# Altium schematic sheet ACD_ACW01_ACWire.SchDoc
size Letter; DocumentNumber: ACD_ACW01_ACWire; SheetNumber: 1; SheetTotal: 1
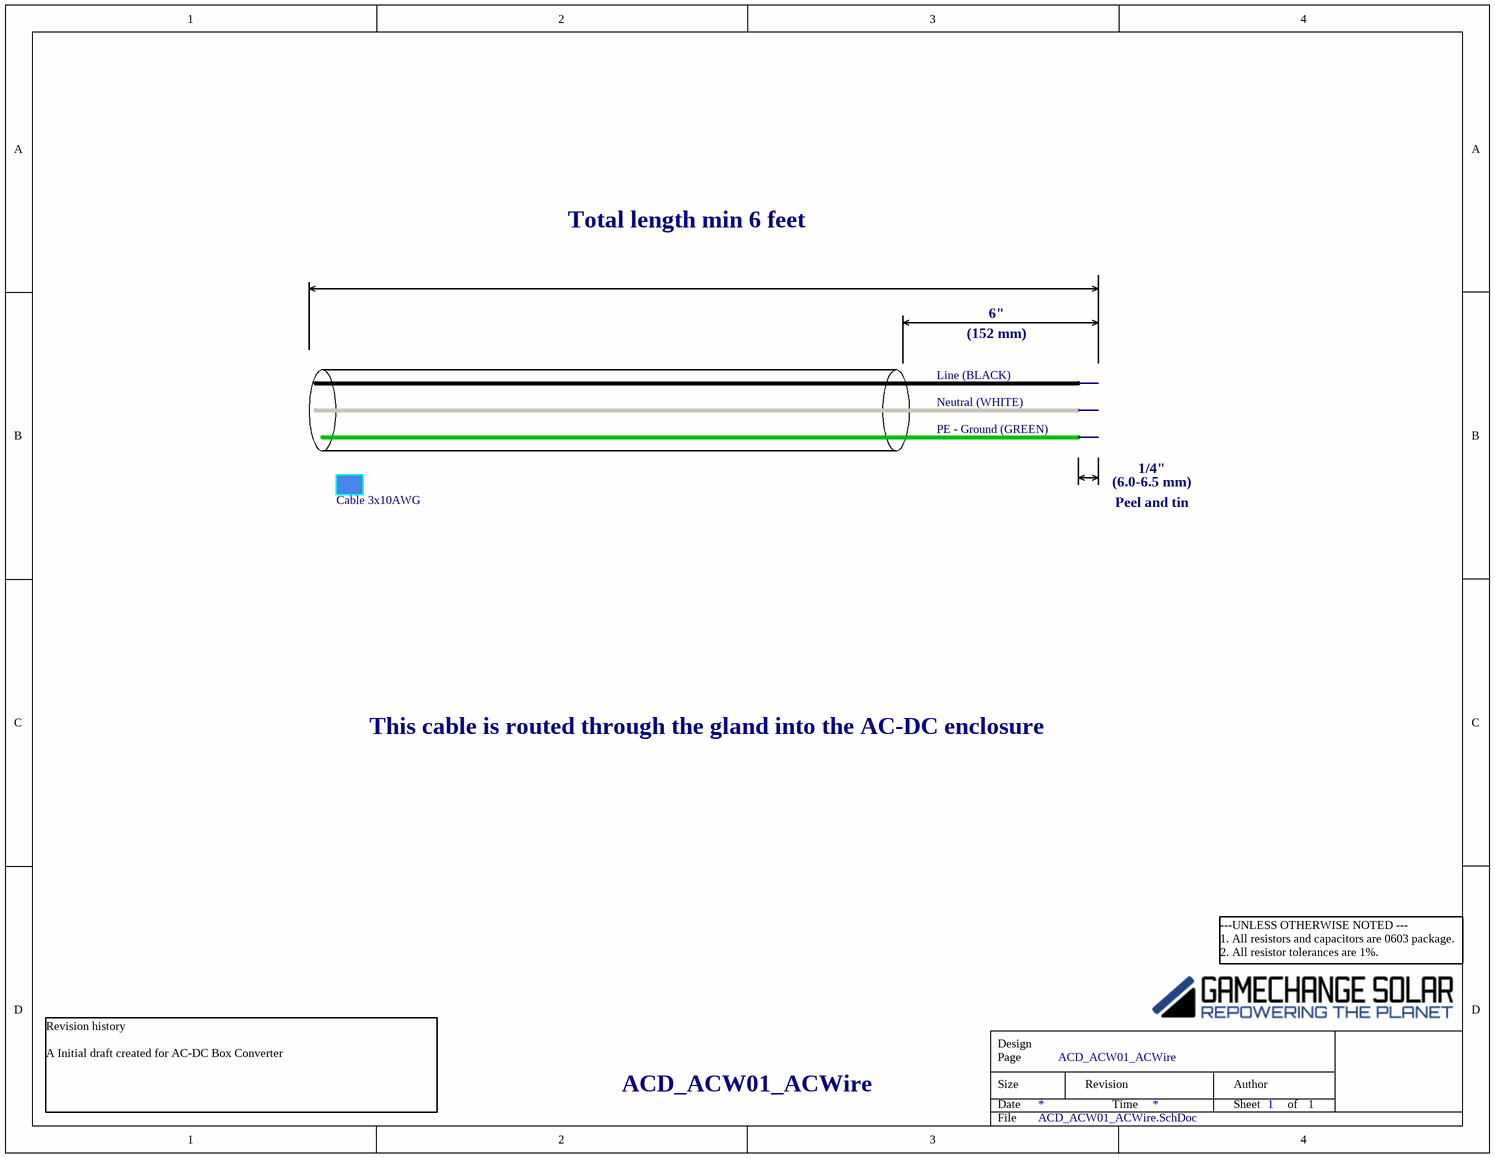
[diagram p0: ACD_ACW01_ACWire.SchDoc]

## Parts
FA13  Cable 3x10AWG

## Notes on the sheet
- Total length min 6 feet
- 6"
- (152 mm)
- Line (BLACK)
- Neutral (WHITE)
- PE - Ground (GREEN)
- 1/4"
- (6.0-6.5 mm)
- Peel and tin
- This cable is routed through the gland into the AC-DC enclosure
- Revision history
  A Initial draft created for AC-DC Box Converter
- ---UNLESS OTHERWISE NOTED ---
  1. All resistors and capacitors are 0603 package.
  2. All resistor tolerances are 1%.
- Design
- Size
- Date
- Page
- Revision
- Time
- Sheet
- Author
- of
- File

## Library data of the parts
FA13 = FA,Cable 3x10AWG: 6Ft 10 Gauge SOOW Wire 10 AWG 600V SOOW Bulk Cable Electrical 3 Conductor 30A Portable Power Cable; MFR1: CLLOMAGY; MPN1: SPC3-005; GCS PN: CABWF00476-6F10A; QTY: 1; MFR2: (Open Source); MPN2: (Open Source)